# Altium schematic sheet power.SchDoc
size A3
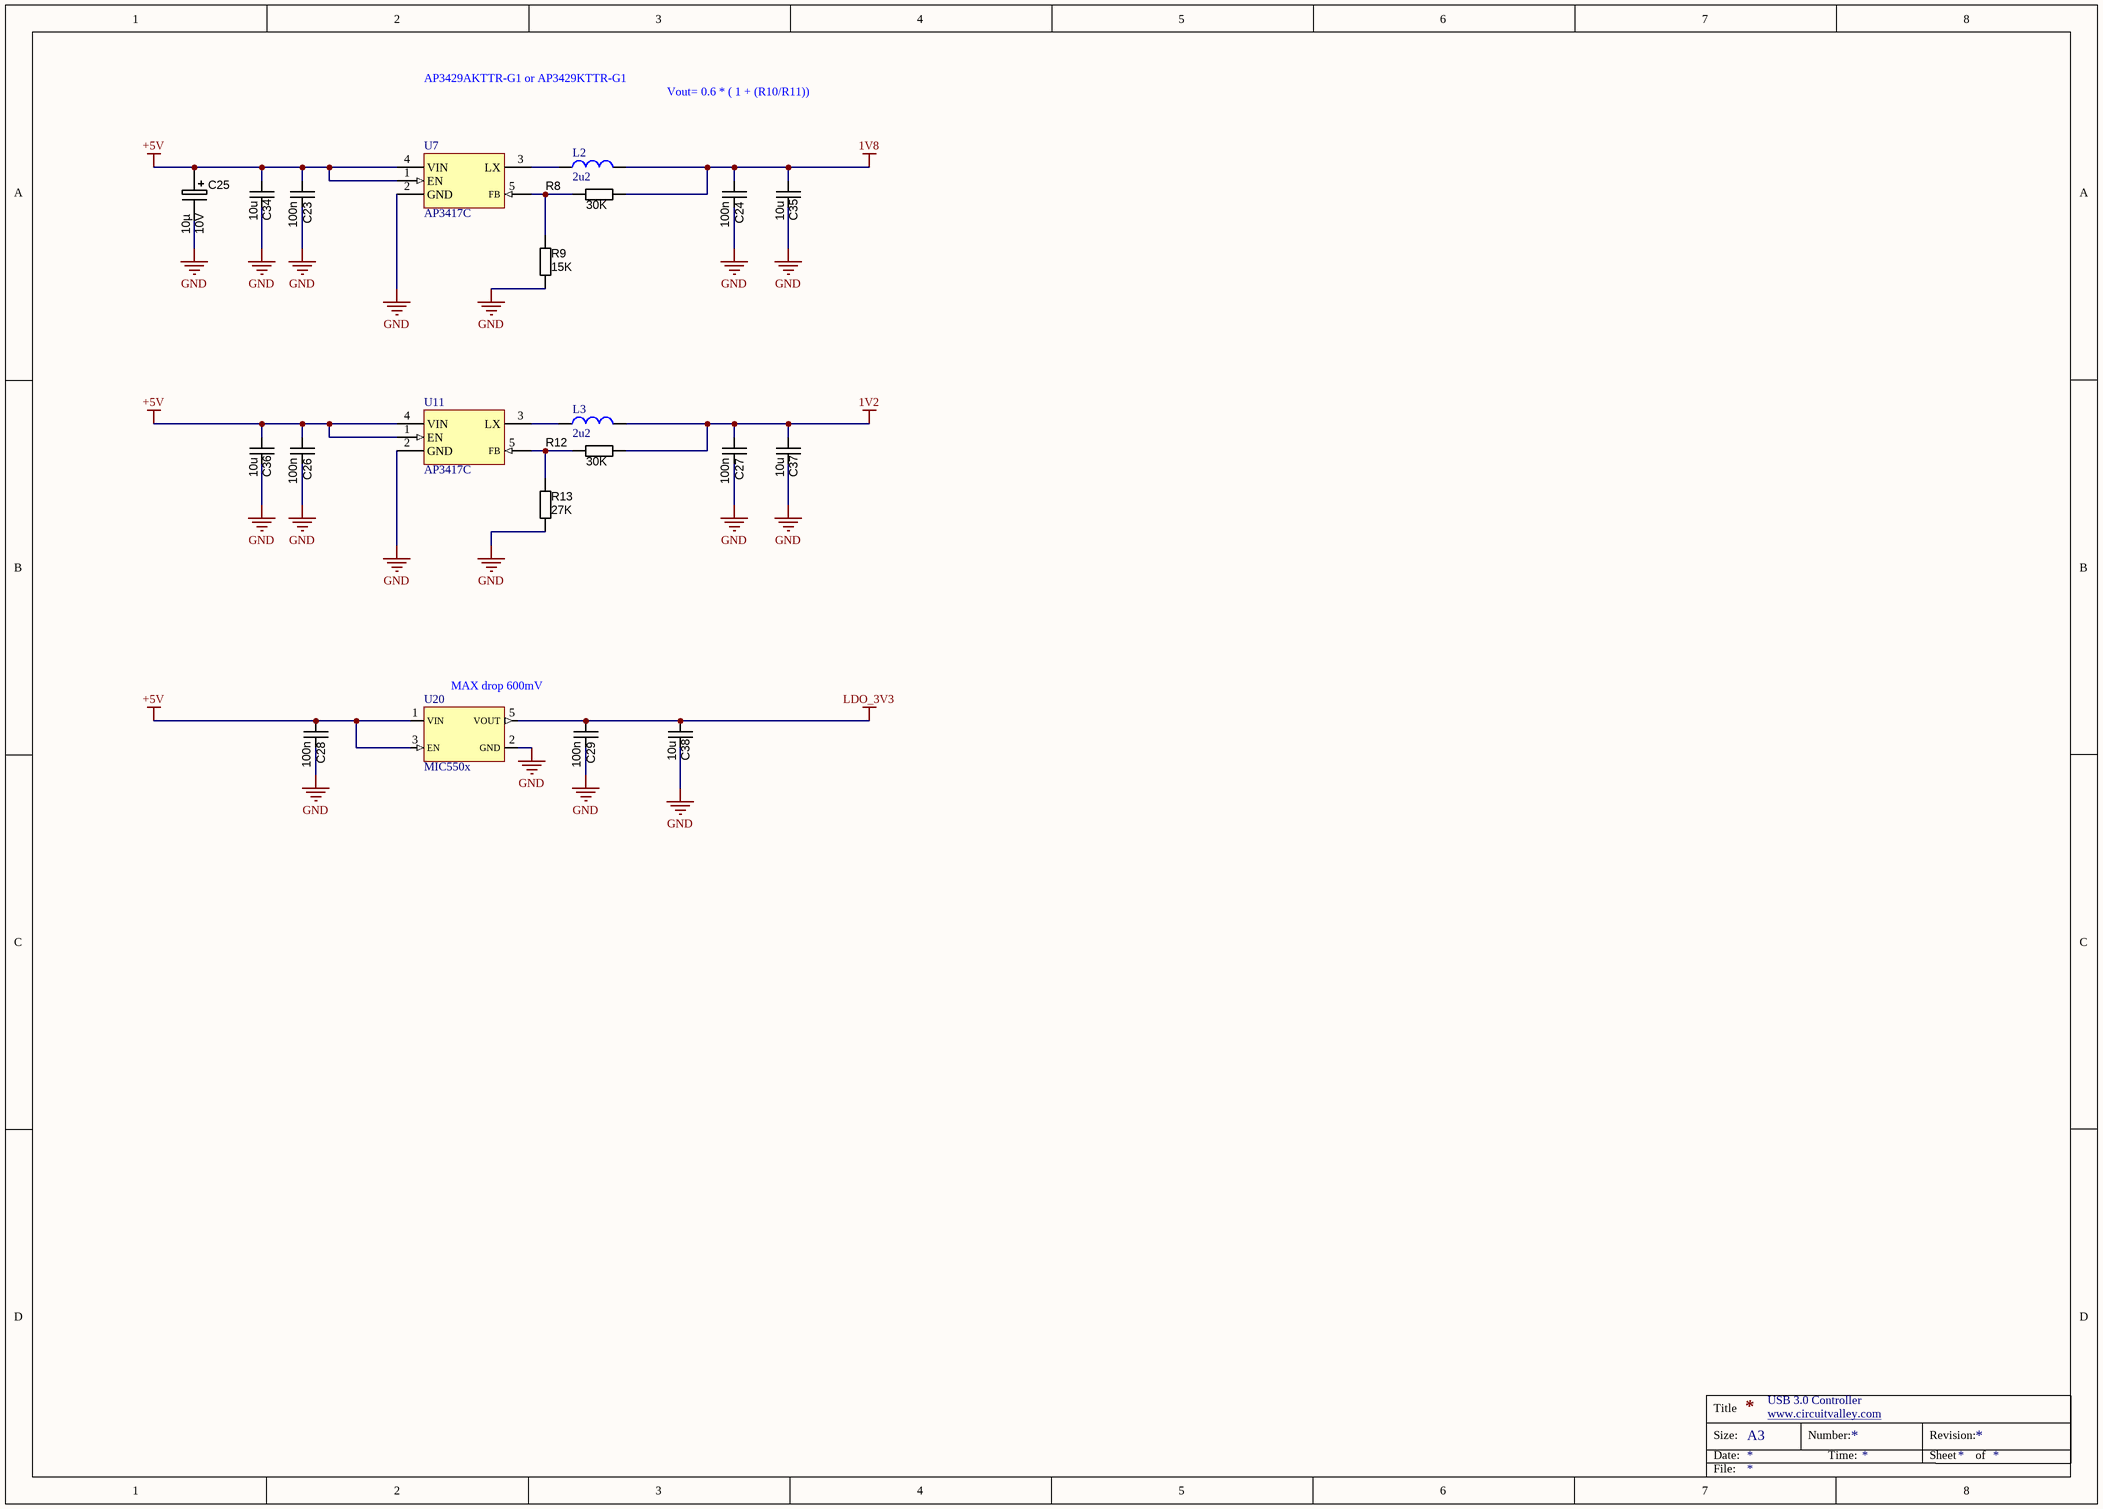
[diagram p0: power.SchDoc]

## Parts
C23  100n  [CAPC1005N]
C24  100n  [CAPC1005N]
C25  Ratings: 10V  [CAPMP3528X210N]  (hidden comment: 10µ)
C26  100n  [CAPC1005N]
C27  100n  [CAPC1005N]
C28  100n  [CAPC1005N]
C29  100n  [CAPC1005N]
C34  value 10u  [CAPC1608N]  (hidden comment: approved sub OK)
C35  value 10u  [CAPC1608N]  (hidden comment: approved sub OK)
C36  value 10u  [CAPC1608N]  (hidden comment: approved sub OK)
C37  value 10u  [CAPC1608N]  (hidden comment: approved sub OK)
C38  value 10u  [CAPC1608N]  (hidden comment: approved sub OK)
L2  2u2  [FDSD0420-H-2R2M]
L3  2u2  [FDSD0420-H-2R2M]
R8  value 30K  [RESC1005N]  (hidden comment: Thick Film)
R9  value 15K  [RESC1005N]  (hidden comment: Thick Film)
R12  value 30K  [RESC1005N]  (hidden comment: Thick Film)
R13  value 27K  [RESC1005N]  (hidden comment: Thick Film)
U7  AP3417C  [SOT23-5]
U11  AP3417C  [SOT23-5]
U20  MIC550x  [SOT23-5]

## Nets
1V2: C27.2 C37.1 L3.2 R12.2
1V8: C24.2 C35.1 L2.2 R8.2
+5V: C23.2 C25.1 C26.2 C28.2 C34.1 C36.1 U7.1(EN) U7.4(VIN) U11.1(EN) U11.4(VIN) U20.1(VIN) U20.3(EN)
GND: C23.1 C24.1 C25.2 C26.1 C27.1 C28.1 C29.1 C34.2 C35.2 C36.2 C37.2 C38.2 R9.2 R13.1 U7.2(GND) U11.2(GND) U20.2(GND)
LDO_3V3: C29.2 C38.1 U20.5(VOUT)
NetL2_1: L2.1 U7.3(LX)
NetL3_1: L3.1 U11.3(LX)
NetR8_1: R8.1 R9.1 U7.5(FB)
NetR12_1: R12.1 R13.2 U11.5(FB)

## Notes on the sheet
- AP3429AKTTR-G1 or AP3429KTTR-G1
- Vout= 0.6 * ( 1 + (R10/R11))
- (near U20) MAX drop 600mV
- USB 3.0 Controller
- www.circuitvalley.com <http://www.circuitvalley.com>
- Title
- Size:
- Date:
- A3
- Number:
- Time:
- Revision:
- Sheet
- of
- File:

## Library data of the parts
C23 C24 C26-C29 = CAPC_10n_0402_16V_10%: Capacitor SMD Cer 10nF 10% 16V X7R 0402; Manufacturer 1: AVX Corporation; Manufacturer Part Number 1: 0402YC103KAT2A; Ratings: 16V; X7R; Tolerance: ±10%; Operating Temperature: -55°C ~ 125°C; Package / Case: 0402 (1005 Metric); Size / Dimension: 0.039" L x 0.020" W (1.00mm x 0.50mm); Manufacturer 2: Yageo; Manufacturer Part Number 2: CC0402KRX7R7BB103; Supplier 1: Digi-Key; Supplier Part Number 1: 478-1114-1-ND; ComponentLink1URL: http://www.avx.com/docs/Catalogs/cx7r.pdf; ComponentLink1Description: http://www.avx.com/docs/Catalogs/cx7r.pdf; Supplier 2: Digi-Key; Supplier Part Number 2: 311-1042-1-ND; ComponentLink2URL: http://www.yageo.com/documents/recent/UPY-GPHC_X7R_6.3V-to-50V_8.pdf; ComponentLink2Description: http://www.yageo.com/documents/recent/UPY-GPHC_X7R_6.3V-to-50V_8.pdf; Value: 100n
C25 = CAPT_47u_1210_6V3: Capacitor SMD Tantalum 47uF 20% 6.3V 1210; Manufacturer 1: AVX Corporation; Manufacturer Part Number 1: TCJB476M006R0070; Manufacturer Size Code: B; Voltage - Rated: 6V3; ESR (Equivalent Series Resistance): 70.0 mOhm; Type: Molded; Package / Case: 1210 (3528 Metric); Tolerance: ±20%; Material: Tantalum; Supplier 1: Digi-Key; Supplier Part Number 1: 478-3139-1-ND; Operating Temperature: -55°C ~ 125°C; Size / Dimension: 0.138" L x 0.110" W (3.50mm x 2.80mm); Height - Seated (Max): 0.083" (2.10mm); ComponentLink1URL: http://www.avx.com/docs/Catalogs/tcj.pdf; ComponentLink1Description: http://www.avx.com/docs/Catalogs/tcj.pdf; Value: 10µ
C34-C38 = CAPC_560p_0603_5%: Capacitor SMD Cer 560pF 5% 50V NP0 0603; Manufacturer 1: AVX Corporation; Manufacturer Part Number 1: 06035A561JAT2A; Ratings: 50V; NP0; Material: ceramic; Capacitance: 470pF; Package / Case: 0603 (1608 metric); Voltage - Rated: 50V; Mounting Type: Surface Mount, MLCC; Operating Temperature: -55°C ~ 125°C; Applications: General Purpose; Size / Dimension: 0.063" L x 0.032" W (1.60mm x 0.81mm); Height - Seated (Max): -; Thickness (Max): 0.035" (0.90mm); Lead Spacing: -; Lead Style: -; ComponentLink1URL: http://www.avx.com/docs/Catalogs/ccog.pdf; ComponentLink1Description: http://www.avx.com/docs/Catalogs/ccog.pdf; Supplier 1: Digi-Key; Supplier Part Number 1: 478-1184-1-ND
L2 L3 = inductor_smd
R8 R9 R12 R13 = RES_3K3_0402_5%: Resistor SMD chip 3.3k Ohm 0.063W 5% 0402; Manufacturer 1: Yageo; Manufacturer Part Number 1: RC0402JR-073K3L; Ratings: 1/16 W; Package / Case: 0402 (1005 metric); Tolerance: ±5%; Material: Thick Film; Supplier 1: Digi-Key; Supplier Part Number 1: 311-3.3KJRCT-ND; ComponentLink1URL: http://www.yageo.com/documents/recent/PYu-RC0402_51_RoHS_L_6.pdf; ComponentLink1Description: http://www.yageo.com/documents/recent/PYu-RC0402_51_RoHS_L_6.pdf